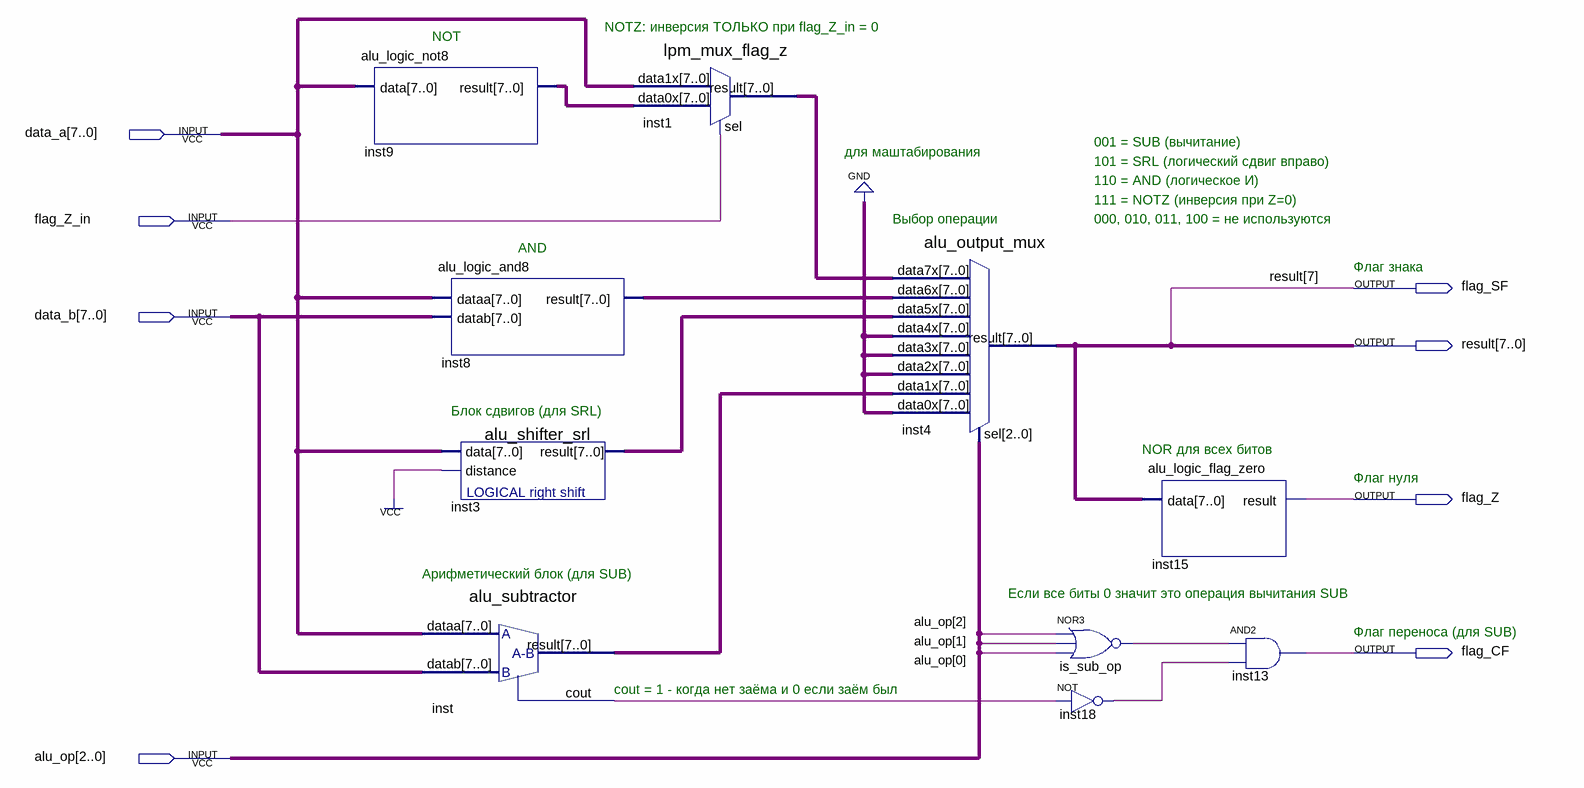
[diagram p0: schematic sheet]
// Quartus schematic alu_unit.bdf as structural Verilog: 10 symbols, 8 pins
module alu_unit (
  input  [7:0] data_a,
  input  flag_Z_in,
  input  [7:0] data_b,
  input  [2:0] alu_op,
  output flag_SF,
  output [7:0] result,
  output flag_Z,
  output flag_CF
);

  wire inst18_out, inst_cout, is_sub_op_out;
  wire [7:0] inst1_result, inst3_result, inst8_result, inst9_result, inst_result;

  alu_logic_not8 inst9 (.data(data_a), .result(inst9_result));
  alu_logic_and8 inst8 (.dataa(data_a), .datab(data_b), .result(inst8_result));
  alu_shifter_srl inst3 (.data(data_a), .distance(1'b1), .result(inst3_result));
  alu_subtractor inst (.dataa(data_a), .datab(data_b), .result(inst_result), .cout(inst_cout));
  lpm_mux_flag_z inst1 (.data1x(data_a), .data0x(inst9_result), .sel(flag_Z_in), .result(inst1_result));
  alu_output_mux inst4 (
    .data7x(inst1_result), .data6x(inst8_result), .data5x(inst3_result), .data4x({8{1'b0}}),
    .data3x({8{1'b0}}), .data2x({8{1'b0}}), .data1x(inst_result), .data0x({8{1'b0}}), .sel(alu_op),
    .result({flag_SF, result[6:0]}));
  nor is_sub_op (is_sub_op_out, alu_op[2], alu_op[1], alu_op[0]);
  not inst18 (inst18_out, inst_cout);
  alu_logic_flag_zero inst15 (.data({flag_SF, result[6:0]}), .result(flag_Z));
  and inst13 (flag_CF, is_sub_op_out, inst18_out);

  assign result[7] = flag_SF;

  // Notes on the sheet:
  //   NOTZ: инверсия ТОЛЬКО при flag_Z_in = 0
  //   NOT
  //   001 = SUB (вычитание)
  //   для маштабирования
  //   101 = SRL (логический сдвиг вправо)
  //   110 = AND (логическое И)
  //   111 = NOTZ (инверсия при Z=0)
  //   Выбор операции
  //   000, 010, 011, 100 = не используются
  //   AND
  //   Флаг знака
  //   Блок сдвигов (для SRL)
  //   NOR для всех битов
  //   Флаг нуля
  //   Арифметический блок (для SUB)
  //   Если все биты 0 значит это операция вычитания SUB
  //   Флаг переноса (для SUB)
  //   cout = 1 - когда нет заёма и 0 если заём был
endmodule
